# Altium schematic sheet ARM_EURO_Platine4.SchDoc
size A4; PageSetup: Record=PageOptions|CenterHorizontal=True|CenterVertical=True|PrintScale=1.00|XCorrection=1.00|YCorrection=1.00|PrintKind=0|BorderSize=5000000|LeftOffset=0|BottomOffset=0|Orientation=2|PaperLength=1000|PaperWidth=1000|Scale=100|PaperSource=7|PrintQuality=-3|MediaType=1|DitherType=10|PrintScaleMode=1|PaperKind=A4|PaperIndex=9
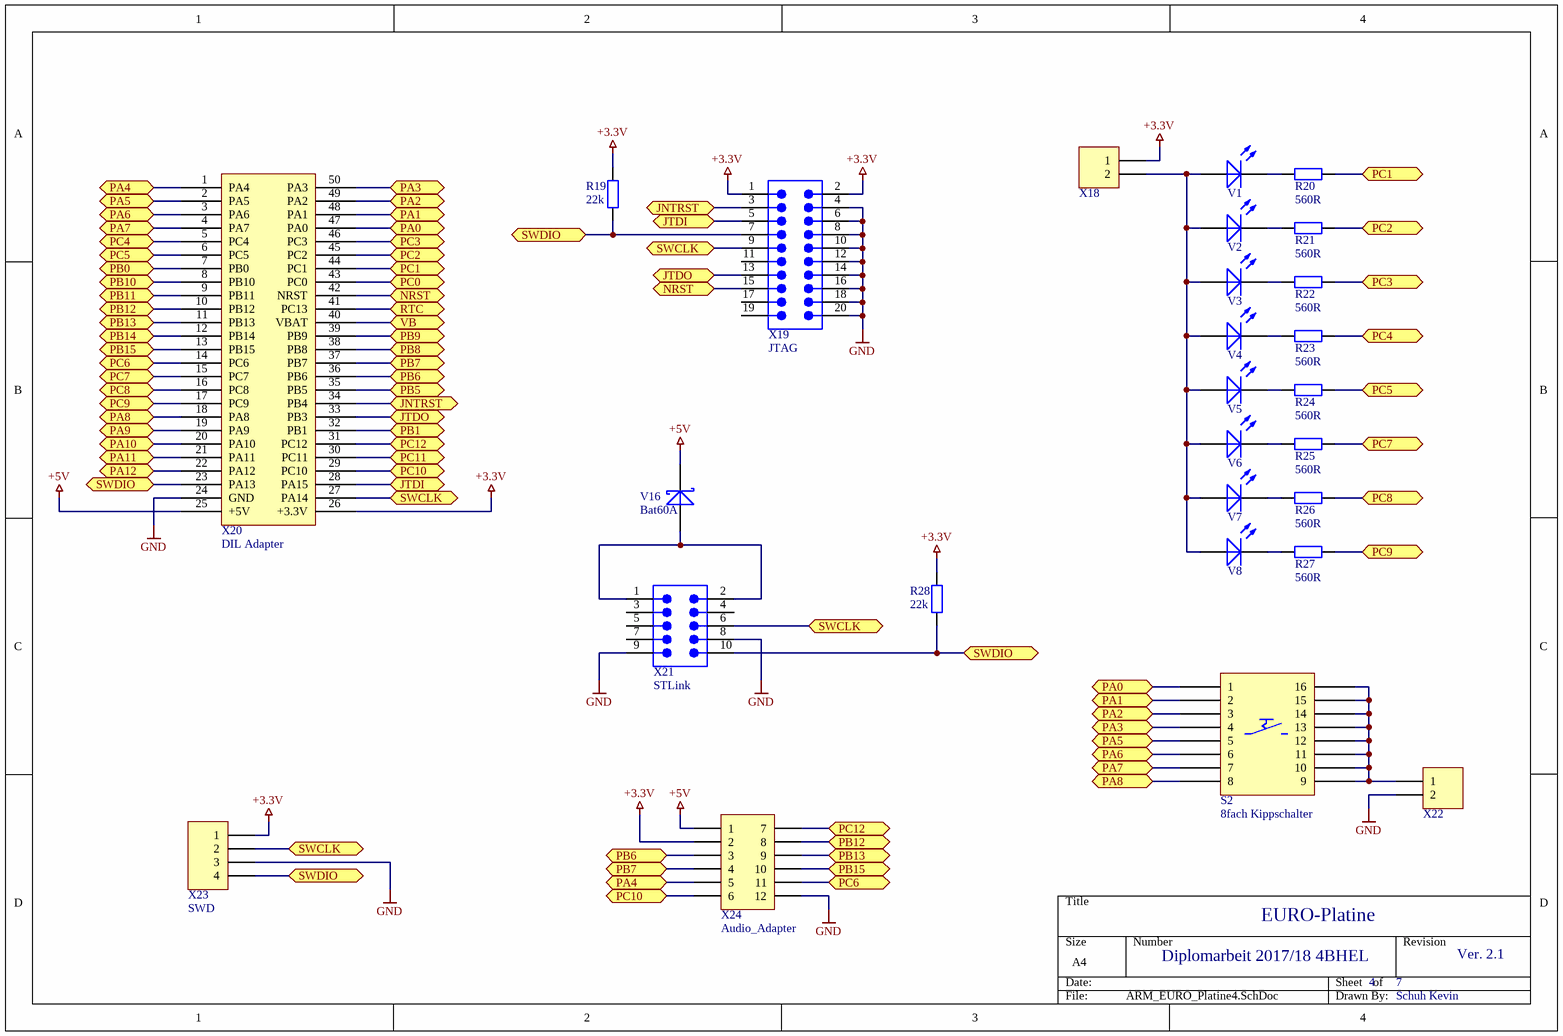
[diagram p0: ARM_EURO_Platine4.SchDoc]

## Parts
R19  value 22k  [0805_Res]  (hidden comment: Res_SMD)
R20  value 560R  [0805_Res]  (hidden comment: Res_SMD)
R21  value 560R  [0805_Res]  (hidden comment: Res_SMD)
R22  value 560R  [0805_Res]  (hidden comment: Res_SMD)
R23  value 560R  [0805_Res]  (hidden comment: Res_SMD)
R24  value 560R  [0805_Res]  (hidden comment: Res_SMD)
R25  value 560R  [0805_Res]  (hidden comment: Res_SMD)
R26  value 560R  [0805_Res]  (hidden comment: Res_SMD)
R27  value 560R  [0805_Res]  (hidden comment: Res_SMD)
R28  value 22k  [0805_Res]  (hidden comment: Res_SMD)
S2  8fach Kippschalter  [DIP_16]
V1  LED  [0805_LED]  (value not drawn)
V2  LED  [0805_LED]  (value not drawn)
V3  LED  [0805_LED]  (value not drawn)
V4  LED  [0805_LED]  (value not drawn)
V5  LED  [0805_LED]  (value not drawn)
V6  LED  [0805_LED]  (value not drawn)
V7  LED  [0805_LED]  (value not drawn)
V8  LED  [0805_LED]  (value not drawn)
V16  Bat60A  [BAT254_Schottky]
X18  Header  [HDR1X2]  (value not drawn)
X19  JTAG  [JTAG_90Grad]
X20  DIL Adapter  [DIL_Adapter_V03]
X21  STLink  [STLink]
X22  Header  [HDR1X2]  (value not drawn)
X23  SWD  [HDR1X4_SWD]
X24  Audio_Adapter  [AUDIO_ADAPTER]

## Ports
JNTRST, JTDI, JTDO, NRST, PA0, PA1, PA2, PA3, PA4, PA5, PA6, PA7, PA8, PA9, PA10, PA11, PA12, PB0, PB1, PB5, PB6, PB7, PB8, PB9, PB10, PB11, PB12, PB13, PB14, PB15, PC0, PC1, PC2, PC3, PC4, PC5, PC6, PC7, PC8, PC9, PC10, PC11, PC12, RTC, SWCLK, SWDIO, VB

## Nets
+3.3V: R19.2 R28.2 X18.1 X19.1 X19.2 X20.26(+3.3V) X23.1 X24.2
+5V: V16.1 X20.25(+5V) X24.1
GND: X19.4 X19.6 X19.8 X19.10 X19.12 X19.14 X19.16 X19.18 X19.20 X20.24(GND) X21.8 X21.9 X22.2 X23.3 X24.12
JNTRST: X19.3 X20.34(PB4) ; port JNTRST
JTDI: X19.5 X20.28(PA15) ; port JTDI
JTDO: X19.13 X20.33(PB3) ; port JTDO
NRST: X19.15 X20.42(NRST) ; port NRST
PA0: S2.1 X20.47(PA0) ; port PA0
PA1: S2.2 X20.48(PA1) ; port PA1
PA2: S2.3 X20.49(PA2) ; port PA2
PA3: S2.4 X20.50(PA3) ; port PA3
PA4: X20.1(PA4) X24.5 ; port PA4
PA5: S2.5 X20.2(PA5) ; port PA5
PA6: S2.6 X20.3(PA6) ; port PA6
PA7: S2.7 X20.4(PA7) ; port PA7
PA8: S2.8 X20.18(PA8) ; port PA8
PA9: X20.19(PA9) ; port PA9
PA10: X20.20(PA10) ; port PA10
PA11: X20.21(PA11) ; port PA11
PA12: X20.22(PA12) ; port PA12
PB0: X20.7(PB0) ; port PB0
PB1: X20.32(PB1) ; port PB1
PB5: X20.35(PB5) ; port PB5
PB6: X20.36(PB6) X24.3 ; port PB6
PB7: X20.37(PB7) X24.4 ; port PB7
PB8: X20.38(PB8) ; port PB8
PB9: X20.39(PB9) ; port PB9
PB10: X20.8(PB10) ; port PB10
PB11: X20.9(PB11) ; port PB11
PB12: X20.10(PB12) X24.8 ; port PB12
PB13: X20.11(PB13) X24.9 ; port PB13
PB14: X20.12(PB14) ; port PB14
PB15: X20.13(PB15) X24.10 ; port PB15
PC0: X20.43(PC0) ; port PC0
PC1: R20.2 X20.44(PC1) ; port PC1
PC2: R21.2 X20.45(PC2) ; port PC2
PC3: R22.2 X20.46(PC3) ; port PC3
PC4: R23.2 X20.5(PC4) ; port PC4
PC5: R24.2 X20.6(PC5) ; port PC5
PC6: X20.14(PC6) X24.11 ; port PC6
PC7: R25.2 X20.15(PC7) ; port PC7
PC8: R26.2 X20.16(PC8) ; port PC8
PC9: R27.2 X20.17(PC9) ; port PC9
PC10: X20.29(PC10) X24.6 ; port PC10
PC11: X20.30(PC11) ; port PC11
PC12: X20.31(PC12) X24.7 ; port PC12
RTC: X20.41(PC13) ; port RTC
SWCLK: X19.9 X20.27(PA14) X21.6 X23.2 ; port SWCLK
SWDIO: R19.1 R28.1 X19.7 X20.23(PA13) X21.10 X23.4 ; port SWDIO
VB: X20.40(VBAT) ; port VB
NetR20_1: R20.1 V1.2(K)
NetR21_1: R21.1 V2.2(K)
NetR22_1: R22.1 V3.2(K)
NetR23_1: R23.1 V4.2(K)
NetR24_1: R24.1 V5.2(K)
NetR25_1: R25.1 V6.2(K)
NetR26_1: R26.1 V7.2(K)
NetR27_1: R27.1 V8.2(K)
NetS2_9: S2.9 S2.10 S2.11 S2.12 S2.13 S2.14 S2.15 S2.16 X22.1
NetV1_1: V1.1(A) V2.1(A) V3.1(A) V4.1(A) V5.1(A) V6.1(A) V7.1(A) V8.1(A) X18.2
NetV16_2: V16.2 X21.1 X21.2

Not connected (* = marked no-connect by the designer): X19 11 17 19; X21 3 4 5 7

## Notes on the sheet
- EURO-Platine
- Diplomarbeit 2017/18 4BHEL
- 4
- 7
- Ver. 2.1
- Schuh Kevin

## Library data of the parts
R19-R28 = Res_SMD: Resistor; Published: 8-Jun-2000; LatestRevisionDate: 17-Jul-2002; LatestRevisionNote: Re-released for DXP Platform.; PackageReference: AXIAL-0.4; Publisher: Altium Limited
S2 = Kippschalter_8fach
V1-V8 = LED_SMD: Typical RED, GREEN, YELLOW, AMBER GaAs LED; Published: 8-Jun-2000; LatestRevisionDate: 17-Jul-2002; LatestRevisionNote: Re-released for DXP Platform.; PackageDocument: Feb-2002; PackageReference: 3.2X1.6X1.1; Publisher: Altium Limited
V16 = Bat60A: Diode
X18 X22 = Header_2: Header, 2-Pin; LatestRevisionDate: 17-Jul-2002; LatestRevisionNote: Re-released for DXP Platform.; Publisher: Altium Limited
X19 = JTAG: Flat Cable Connector (IDC), Low-Profile Male Header, Straight Solder Pin, 20 Contacts, Performance Level 2; PCB_Layout: Complies with manufacturer's recommendation.; DrillSize: Corresponds to nominal value.; Published: 15-Nov-2004; DatasheetDocument: Sep-2003; PackageDocument: 01-Feb-2000; PackageReference: 918520x324; Publisher: Altium Limited; ComponentLink1Description: Manufacturer Link; ComponentLink1URL: http://www.harting.com/; ComponentLink2Description: Selection Guide; ComponentLink2URL: http://www.harting.com/imperia/md/content/steckverbinderundsystemkomponenten/folder/interface_engl_chapter_09.pdf
X20 = DIL_Adapter_V03: DIL Adapter 50 Pin
X21 = STLink: Flat Cable Connector (IDC), Low-Profile Male Header, Straight Solder Pin, 20 Contacts, Performance Level 2; PCB_Layout: Complies with manufacturer's recommendation.; DrillSize: Corresponds to nominal value.; Published: 15-Nov-2004; DatasheetDocument: Sep-2003; PackageDocument: 01-Feb-2000; PackageReference: 918520x324; Publisher: Altium Limited; ComponentLink1Description: Manufacturer Link; ComponentLink1URL: http://www.harting.com/; ComponentLink2Description: Selection Guide; ComponentLink2URL: http://www.harting.com/imperia/md/content/steckverbinderundsystemkomponenten/folder/interface_engl_chapter_09.pdf
X23 = SWD: Header, 4-Pin; LatestRevisionDate: 17-Jul-2002; LatestRevisionNote: Re-released for DXP Platform.; Publisher: Altium Limited
X24 = Audio_Adapter: Header, 6-Pin, Dual row; LatestRevisionDate: 17-Jul-2002; LatestRevisionNote: Re-released for DXP Platform.; Publisher: Altium Limited